# Altium schematic sheet Sheet7.SchDoc
size A; SheetNumber: 1; SheetTotal: 1
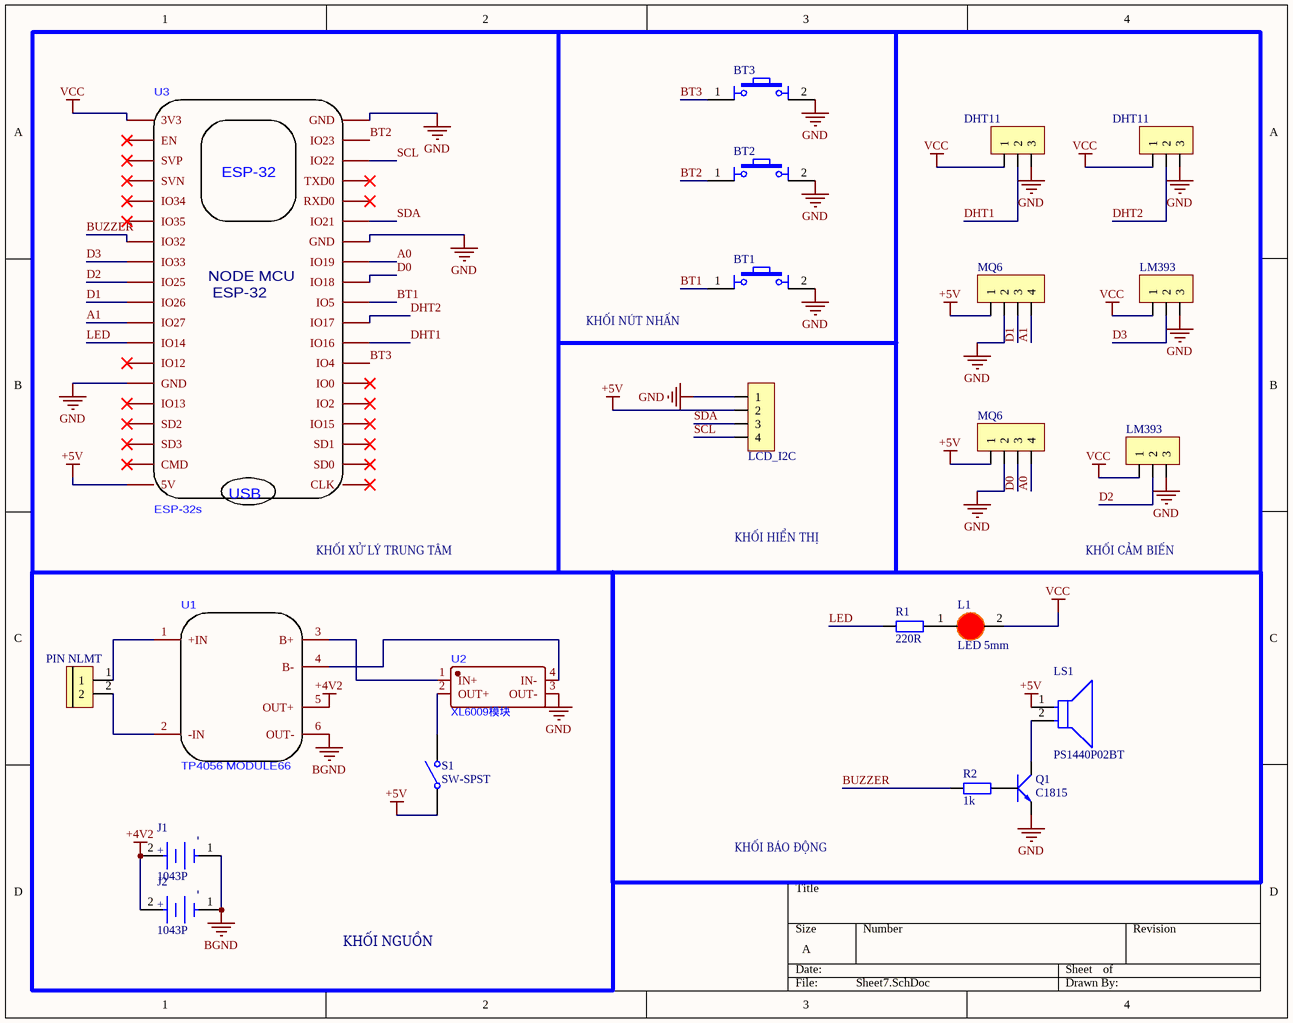
[diagram p0: Sheet7.SchDoc]

## Parts
BT1  Nut Nhan 4 Chan Cam 6x6  [Nut Nhan 4 Chan Cam 6x6]  (value not drawn)
BT2  Nut Nhan 4 Chan Cam 6x6  [Nut Nhan 4 Chan Cam 6x6]  (value not drawn)
BT3  Nut Nhan 4 Chan Cam 6x6  [Nut Nhan 4 Chan Cam 6x6]  (value not drawn)
J1  1043P  [FP-1043P-MFG]
J2  1043P  [FP-1043P-MFG]
JP1  DHT11  [JP 1x3 DT]
JP2  DHT11  [JP 1x3 DT]
JP3  MQ6  [JP 1x4 DT]
JP4  LM393  [JP 1x3 DT]
JP5  LCD_I2C  [JP 1x4 DT]
JP6  MQ6  [JP 1x4 DT]
JP7  LM393  [JP 1x3 DT]
L1  LED 5mm  [LED-5MM-RED]
LS1  PS1440P02BT  [FP-PS1440P02BT-MFG]
PIN_NLMT  CON 2 KF301  [Con 2 KF301 5.08]  (value not drawn)
Q1  C1815  [TO92]
R1  220R  [tro vach 1/4w]
R2  1k  [tro vach 1/4w]
S1  SW-SPST  [SPST-2]
U1  TP4056 MODULE66  [TP4056MODULE]
U2  XL6009模块  [XFMR-SMD_XL6009]
U3  ESP-32s  [ESP-32S]

## Blocks framed on the sheet
KHỐI NGUỒN: J1 J2 PIN_NLMT S1 U1 U2

## Nets
+4V2: J1.2(A) J2.2(A) U1.5(OUT+)
+5V: JP3.1 JP5.2 JP6.1 LS1.1 S1.1(COMMON) U3.19(5V)
BGND: J1.1(C) J2.1(C) U1.6(OUT-)
GND: BT1.2 BT2.2 BT3.2 JP1.3 JP2.3 JP3.2 JP4.3 JP5.1 JP6.2 JP7.3 Q1.1(E) U2.3(OUT-) U3.14(GND) U3.32(GND) U3.38(GND)
VCC: JP1.1 JP2.1 JP4.1 JP7.1 L1.2(K) U3.1(3V3)
A0: JP6.4 U3.31(IO19)
A1: JP3.4 U3.11(IO27)
BT1: BT1.1 U3.29(IO5)
BT2: BT2.1 U3.37(IO23)
BT3: BT3.1 U3.26(IO4)
BUZZER: R2.1 U3.7(IO32)
D0: JP6.3 U3.30(IO18)
D1: JP3.3 U3.10(IO26)
D2: JP7.2 U3.9(IO25)
D3: JP4.2 U3.8(IO33)
DHT1: JP1.2 U3.27(IO16)
DHT2: JP2.2 U3.28(IO17)
LED: R1.1 U3.12(IO14)
SCL: JP5.4 U3.36(IO22)
SDA: JP5.3 U3.33(IO21)
NetL1_1: L1.1(A) R1.2
NetLS1_2: LS1.2 Q1.2(C)
NetPIN_NLMT_1: PIN_NLMT.1 U1.1(+IN)
NetPIN_NLMT_2: PIN_NLMT.2 U1.2(-IN)
NetQ1_3: Q1.3(B) R2.2
NetS1_2: S1.2(NO) U2.2(OUT+)
NetU1_3: U1.3(B+) U2.1(IN+)
NetU1_4: U1.4(B-) U2.4(IN-)

Not connected (* = marked no-connect by the designer): U3 2(EN)* 3(SVP)* 4(SVN)* 5(IO34)* 6(IO35)* 13(IO12)* 15(IO13)* 16(SD2)* 17(SD3)* 18(CMD)* 20(CLK)* 21(SD0)* 22(SD1)* 23(IO15)* 24(IO2)* 25(IO0)* 34(RXD0)* 35(TXD0)*

## Notes on the sheet
- KHỐI NÚT NHẤN
- KHỐI XỬ LÝ TRUNG TÂM
- KHỐI HIỂN THỊ
- KHỐI CẢM BIẾN
- KHỐI BÁO ĐỘNG
- (in symbol CMP-19636-000034-1) +
- (in symbol ESP-32s) ESP-32; NODE MCU / ESP-32; USB

## Library data of the parts
BT1-BT3 = Nut Nhan 4 Chan Cam 6x6: Nut Nhan 4 Chan 6x6mm; Ten: Nút Nhấn 4 Chân 6x6x5MM DIP; Ma_Hang: MH004584
J1 J2 = CMP-19636-000034-1: BATT HOLDER 18650 1 CELL PC PIN; Number of Cells: 1; Series: -; Termination: PC Pin; Package Quantity: 50; Min Operating Temperature: -50°C; Mount: Through Hole; Packaging: Tray; Max Operating Temperature: 145°C
JP1 JP2 JP4 JP7 = JP 1x3 2.54 Duc Thang: Cắm; Ten_Linh_Kien: Jump Đơn Đực 2.54MM 1x40P Thẳng 11MM; Don_Vi: Con; Ma_Hang: MH000903; Ghi_Chu: *; Kieu_Chan: *; Chung_Loai: Cắm
JP3 JP5 JP6 = JP 1x4 2.54 Duc Thang: Cắm; Ten_Linh_Kien: Jump Đơn Đực 2.54MM 1x40P Thẳng 11MM; Don_Vi: Con; Ma_Hang: MH000903; Ghi_Chu: *; Kieu_Chan: *; Chung_Loai: Cắm
L1 = LED 5mm Do: Cắm; Don_Vi: Con; Ma_Hang: MH008967; Ten_Linh_Kien: Led 5MM Phủ Đỏ (1000c); Ghi_Chu: *; Kieu_Chan: *; Chung_Loai: Cắm
LS1 = CMP-08413-000003-1: AUDIO PIEZO TRANSDUCER 30V TH; Self Resonant Frequency: 4kHz; Washable: No; Voltage Rating (DC): 3V; Number of Terminals/Pins: 2; Packaging: Tape and Reel; Lead Free: Lead Free; Min Operating Temperature: -10°C; Package Quantity: 350; Termination: PC Pins; Mount: Through Hole; Max Operating Temperature: 70°C; Operating Supply Voltage: 3V; Diameter: 14mm; RoHS Compliant: Yes; Frequency: 4kHz; Height: 8mm
PIN_NLMT = CON 2 KF301: Cắm; Ma_Hang: MH000987; Ten_Linh_Kien: CON 2 KF301-2P 5.08MM Xanh Dương; Chung_Loai: Cắm; Ghi_Chu: *; Kieu_Chan: *; Don_Vi: Con
Q1 = C1815: NPN transistor; Value: C9014
R1 = Tro Vach 1/4W 5% 220R: Cắm; Don_Vi: Con; So_Chan: 2; Ten_Linh_Kien: Trở Vạch 1/4w 5% 220R; Ma_Hang: MH007300; Chung_Loai: Cắm; Kieu_Chan: *
R2 = Tro Vach 1/4W 5% 1k: Cắm; Don_Vi: Con; So_Chan: 2; Ten_Linh_Kien: Trở Vạch 1/4w 5% 1k; Ma_Hang: MH007390; Chung_Loai: Cắm; Kieu_Chan: *
S1 = SW-SPST: Single-Pole, Single-Throw Switch; Published: 24-Mar-1999; LatestRevisionDate: 17-Jul-2002; LatestRevisionNote: Re-released for DXP Platform.; PackageReference: SPST-2; Publisher: Altium Limited; PackageDescription: Switch; 2 Leads